# EAGLE schematic NMEA_Temperatursensor (EAGLE 9.6.2)
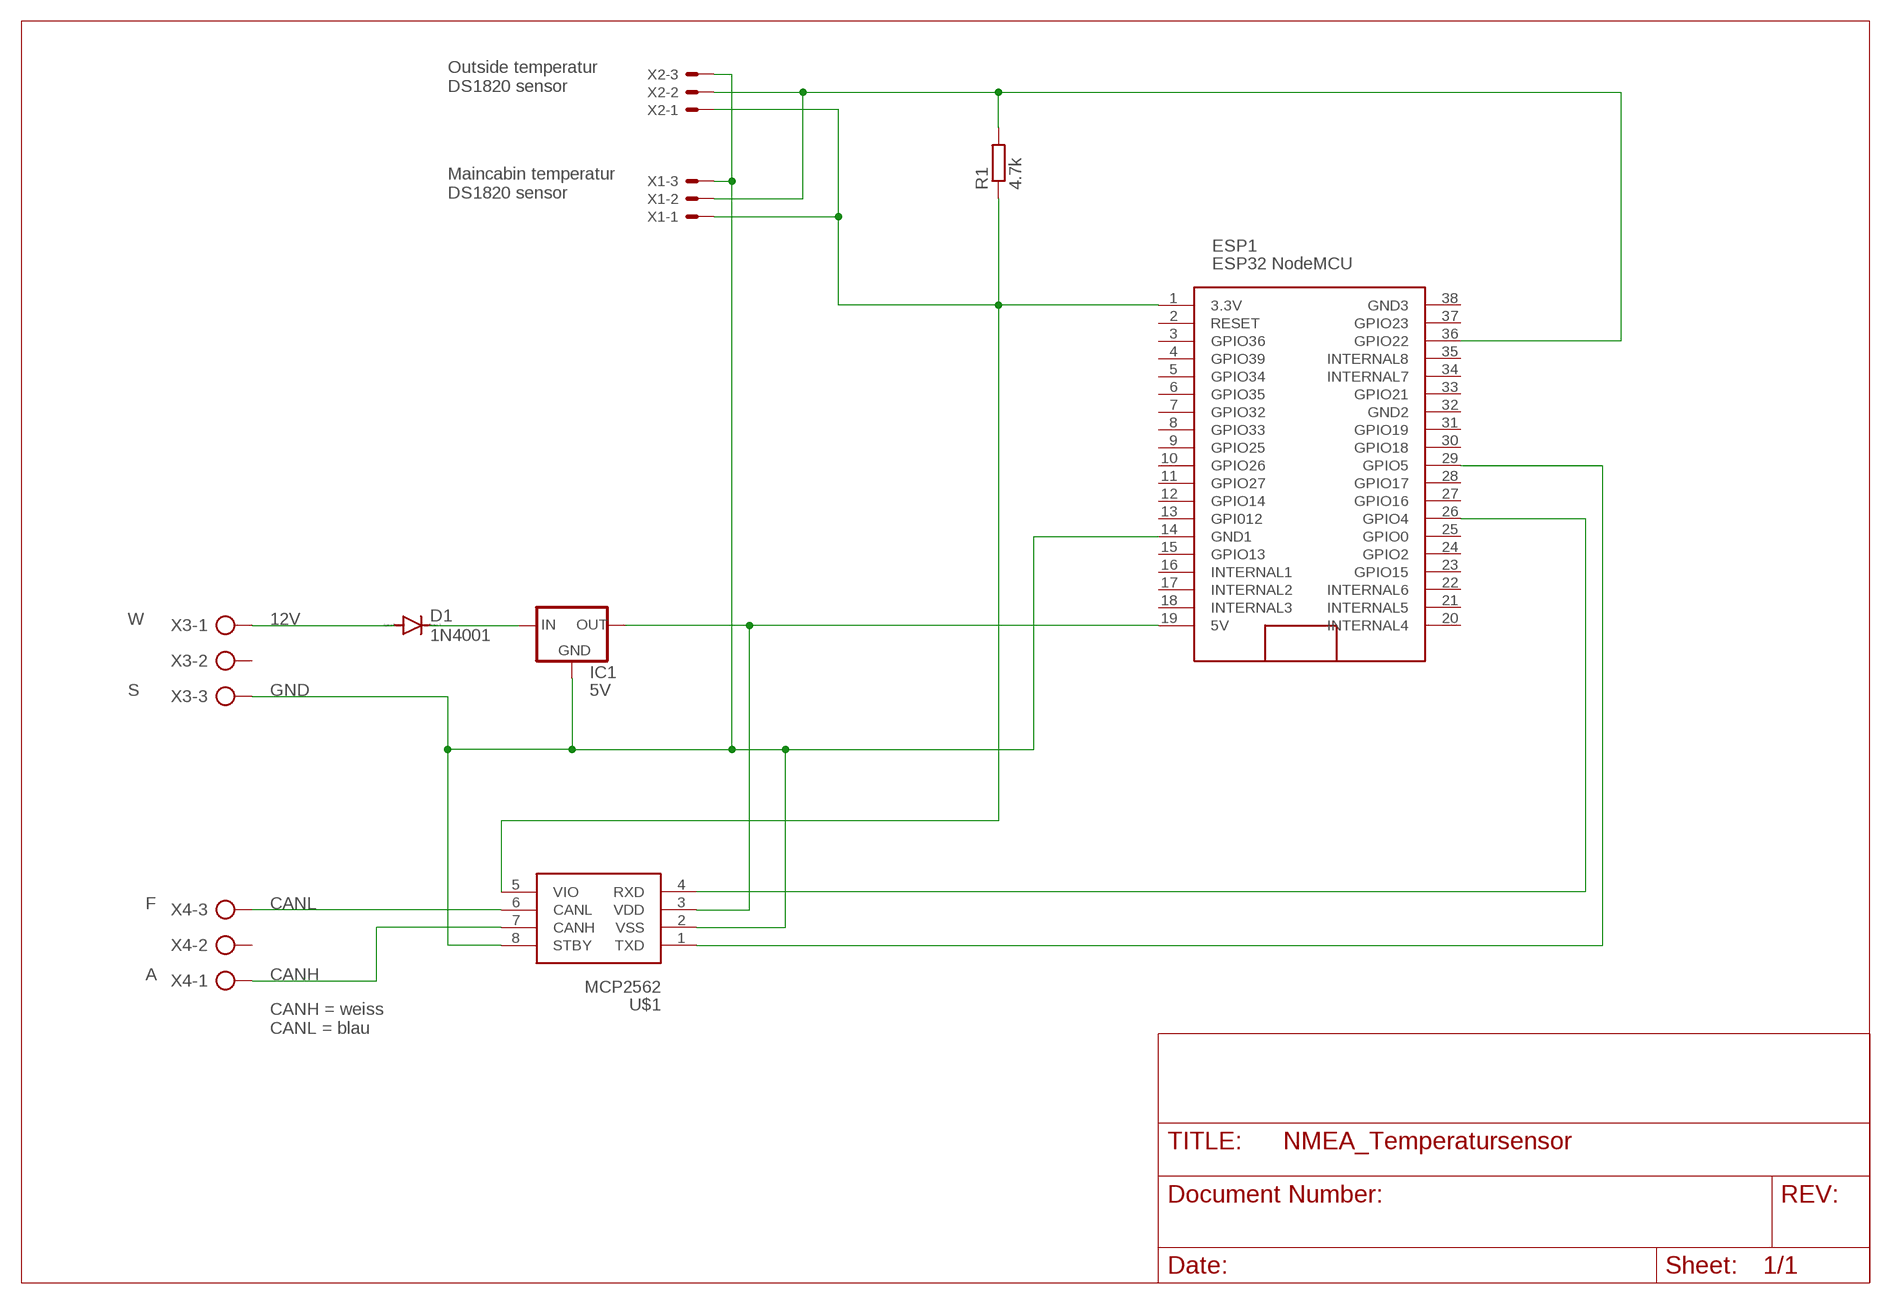
[diagram p0: schematic, sheet 1]

## Parts
D1  1N4001  1N4004  [DO41-10]
ESP1  ESP32 NodeMCU  ESP32-NODEMCU  [ESP32_NODEMCU]
IC1  5V  78XXS  [78XXS]
R1  4.7k  R-EU_0204/7  [0204/7]
U$1  MCP2562  [DIL08]
X1  22-23-2031  [22-23-2031]
X2  22-23-2031  [22-23-2031]
X3  AK300/3  [AK300/3]
X4  AK300/3  [AK300/3]

## Nets
12V: D1.A X3.1
CANH: U$1.7(CANH) X4.1
CANL: U$1.6(CANL) X4.3
GND: ESP1.14(GND1) IC1.GND U$1.2(VSS) U$1.8(STBY) X1.3 X2.3 X3.3
N$1: ESP1.26(GPIO4) U$1.4(RXD)
N$2: ESP1.29(GPIO5) U$1.1(TXD)
N$3: ESP1.19(5V) IC1.OUT U$1.3(VDD)
N$4: ESP1.36(GPIO22) R1.2 X1.2 X2.2
N$5: D1.C IC1.IN
N$8: ESP1.1(3.3V) R1.1 U$1.5(VIO) X1.1 X2.1
Unconnected: ESP1.2(RESET) ESP1.3(GPIO36) ESP1.4(GPIO39) ESP1.5(GPIO34) ESP1.6(GPIO35) ESP1.7(GPIO32) ESP1.8(GPIO33) ESP1.9(GPIO25) ESP1.10(GPIO26) ESP1.11(GPIO27) ESP1.12(GPIO14) ESP1.13(GPI012) ESP1.15(GPIO13) ESP1.16(INTERNAL1) ESP1.17(INTERNAL2) ESP1.18(INTERNAL3) ESP1.20(INTERNAL4) ESP1.21(INTERNAL5) ESP1.22(INTERNAL6) ESP1.23(GPIO15) ESP1.24(GPIO2) ESP1.25(GPIO0) ESP1.27(GPIO16) ESP1.28(GPIO17) ESP1.30(GPIO18) ESP1.31(GPIO19) ESP1.33(GPIO21) ESP1.34(INTERNAL7) ESP1.35(INTERNAL8) ESP1.37(GPIO23) X3.2 X4.2

## Notes on the sheet
- Outside temperatur
  DS1820 sensor
- Maincabin temperatur
  DS1820 sensor
- W
- S
- F
- A
- CANH = weiss
  CANL = blau

## Power pins joined to a net without a drawn wire
GND2: ESP1.32(GND2)
GND3: ESP1.38(GND3)

## Library data of the parts
D1 = diode:1N4004: DIODE general purpose rectifier, 1 A
ESP1 = _esp32:ESP32-NODEMCU
IC1 = v-reg:78XXS: VOLTAGE REGULATOR
R1 = rcl:R-EU_: RESISTOR, European symbol; SPICEPREFIX: R
U$1 = _eigene:MCP2562
X1 X2 = con-molex:22-23-2031: .100" (2.54mm) Center Header - 3 Pin; MF: MOLEX; MPN: 22-23-2031; OC_FARNELL: 1462950; OC_NEWARK: 30C0862
X3 X4 = con-ptr500:AK300/3: CONNECTOR; OC_FARNELL: unknown; OC_NEWARK: unknown